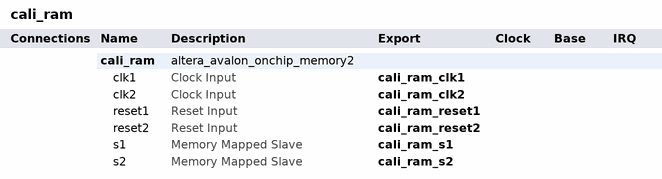
[diagram p0: system contents]
# Platform Designer (Qsys) system cali_ram, MAX 10 10M50DAF484C6GES
# Parameters at their usual value, and those the tool derives, are not listed.
package require -exact qsys 19.1
create_system cali_ram
set_project_property DEVICE_FAMILY {MAX 10}
set_project_property DEVICE 10M50DAF484C6GES

add_instance cali_ram altera_avalon_onchip_memory2 19.1
set_instance_parameter_value cali_ram dataWidth 16
set_instance_parameter_value cali_ram dualPort true
set_instance_parameter_value cali_ram initMemContent false
set_instance_parameter_value cali_ram initializationFileName onchip_mem.hex
set_instance_parameter_value cali_ram memorySize 640
set_instance_parameter_value cali_ram resetrequest_enabled false

# exported interfaces
add_interface cali_ram_clk1 clock sink
set_interface_property cali_ram_clk1 EXPORT_OF cali_ram.clk1
add_interface cali_ram_clk2 clock sink
set_interface_property cali_ram_clk2 EXPORT_OF cali_ram.clk2
add_interface cali_ram_reset1 reset sink
set_interface_property cali_ram_reset1 EXPORT_OF cali_ram.reset1
add_interface cali_ram_reset2 reset sink
set_interface_property cali_ram_reset2 EXPORT_OF cali_ram.reset2
add_interface cali_ram_s1 avalon slave
set_interface_property cali_ram_s1 EXPORT_OF cali_ram.s1
add_interface cali_ram_s2 avalon slave
set_interface_property cali_ram_s2 EXPORT_OF cali_ram.s2

set_interconnect_requirement {$system} qsys_mm.clockCrossingAdapter HANDSHAKE
set_interconnect_requirement {$system} qsys_mm.enableEccProtection FALSE
set_interconnect_requirement {$system} qsys_mm.insertDefaultSlave FALSE
set_interconnect_requirement {$system} qsys_mm.maxAdditionalLatency 1

save_system cali_ram.qsys
